# EAGLE design mcp23007_uln2803a (EAGLE 7.6.0)
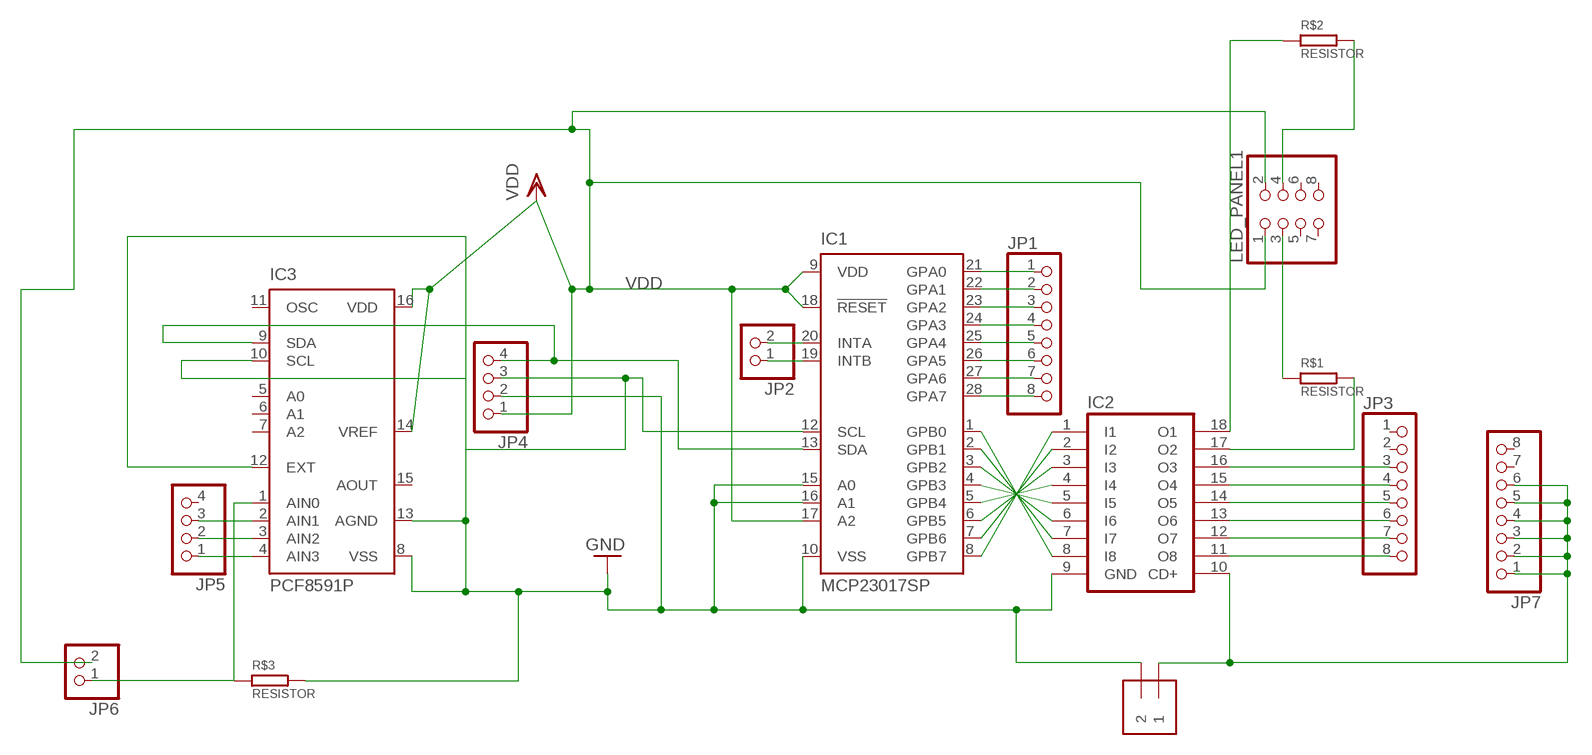
[diagram p0: schematic, sheet 1]

## Parts
IC1  MCP23017SP  [DIL28-3]
IC2  ULN2803A  [DIL18]
IC3  PCF8591P  [DIL16]
JP1  PINHD-1X8  [1X08]
JP2  PINHD-1X2  [1X02]
JP3  PINHD-1X8  [1X08]
JP4  PINHD-1X4  [1X04]
JP5  PINHD-1X4  [1X04]
JP6  PINHD-1X2  [1X02]
JP7  PINHD-1X8  [1X08]
LED_PANEL1  PINHD-2X4  [2X04]
R$1  RESISTOR  [RESISTOR_1/4]
R$2  RESISTOR  [RESISTOR_1/4]
R$3  RESISTOR  [RESISTOR_1/4]
VCC  1X2-3.5MM  [1X2-3.5MM]

## Nets
GND: IC1.10(VSS) IC1.15(A0) IC1.16(A1) IC2.9(GND) IC3.8(VSS) IC3.12(EXT) IC3.13(AGND) JP4.2 R$3.P$1 VCC.2
N$1: IC1.1(GPB0) IC2.8(I8)
N$2: IC1.8(GPB7) IC2.1(I1)
N$3: IC1.7(GPB6) IC2.2(I2)
N$4: IC1.2(GPB1) IC2.7(I7)
N$5: IC1.6(GPB5) IC2.3(I3)
N$6: IC1.3(GPB2) IC2.6(I6)
N$7: IC1.5(GPB4) IC2.4(I4)
N$8: IC1.4(GPB3) IC2.5(I5)
N$9: IC1.21(GPA0) JP1.1
N$10: IC1.22(GPA1) JP1.2
N$11: IC1.23(GPA2) JP1.3
N$12: IC1.24(GPA3) JP1.4
N$13: IC1.25(GPA4) JP1.5
N$14: IC1.26(GPA5) JP1.6
N$15: IC1.27(GPA6) JP1.7
N$16: IC1.28(GPA7) JP1.8
N$19: IC2.16(O3) JP3.3
N$20: IC2.15(O4) JP3.4
N$21: IC2.14(O5) JP3.5
N$22: IC2.13(O6) JP3.6
N$23: IC2.12(O7) JP3.7
N$24: IC2.11(O8) JP3.8
N$25: IC2.10(CD+) JP7.1 JP7.2 JP7.3 JP7.4 JP7.5 JP7.6 VCC.1
N$26: IC1.19(INTB) JP2.1
N$27: IC1.20(INTA) JP2.2
N$28: IC1.13(SDA) IC3.9(SDA) JP4.4
N$29: IC1.12(SCL) IC3.10(SCL) JP4.3
N$30: IC3.4(AIN3) JP5.1
N$31: IC3.3(AIN2) JP5.2
N$32: IC3.2(AIN1) JP5.3
N$33: IC3.1(AIN0) JP6.1 R$3.P$2
N$34: IC2.18(O1) R$2.P$2
N$35: LED_PANEL1.3 R$1.P$2
N$36: IC2.17(O2) R$1.P$1
N$39: LED_PANEL1.4 R$2.P$1
VDD: IC1.9(VDD) IC1.17(A2) IC1.18(!RESET) IC3.14(VREF) IC3.16(VDD) JP4.1 JP6.2 LED_PANEL1.1 LED_PANEL1.2
Unconnected: IC3.5(A0) IC3.6(A1) IC3.7(A2) IC3.11(OSC) IC3.15(AOUT) JP3.1 JP3.2 JP5.4 JP7.7 JP7.8 LED_PANEL1.5 LED_PANEL1.6 LED_PANEL1.7 LED_PANEL1.8

## Library data of the parts
IC1 = microchip:MCP23017: http://ww1.microchip.com/downloads/en/DeviceDoc/21952a.pdf Source: http://ww1.microchip.com/downloads/en/DeviceDoc/21952a.pdf; MF: MICROCHIP; MPN: MCP23017-E/SP; OC_FARNELL: 1332088; OC_NEWARK: 31K2959
IC2 = uln-udn:ULN2803A: DRIVER ARRAY
IC3 = micro-philips:PCF8591: I2C-Bus D/A CONVERTER; MF: FARNELL; MPN: PCF8591P; OC_FARNELL: 396412; OC_NEWARK: 07WX3385
JP1 JP3 JP7 = pinhead:PINHD-1X8: PIN HEADER
JP2 JP6 = pinhead:PINHD-1X2: PIN HEADER
JP4 JP5 = pinhead:PINHD-1X4: PIN HEADER
LED_PANEL1 = pinhead:PINHD-2X4: PIN HEADER
R$1-R$3 = pigoda:RESISTOR
VCC = adafruit:1X2: 3.5mm Terminal block http://www.ladyada.net/library/pcb/eaglelibrary.html

## Board
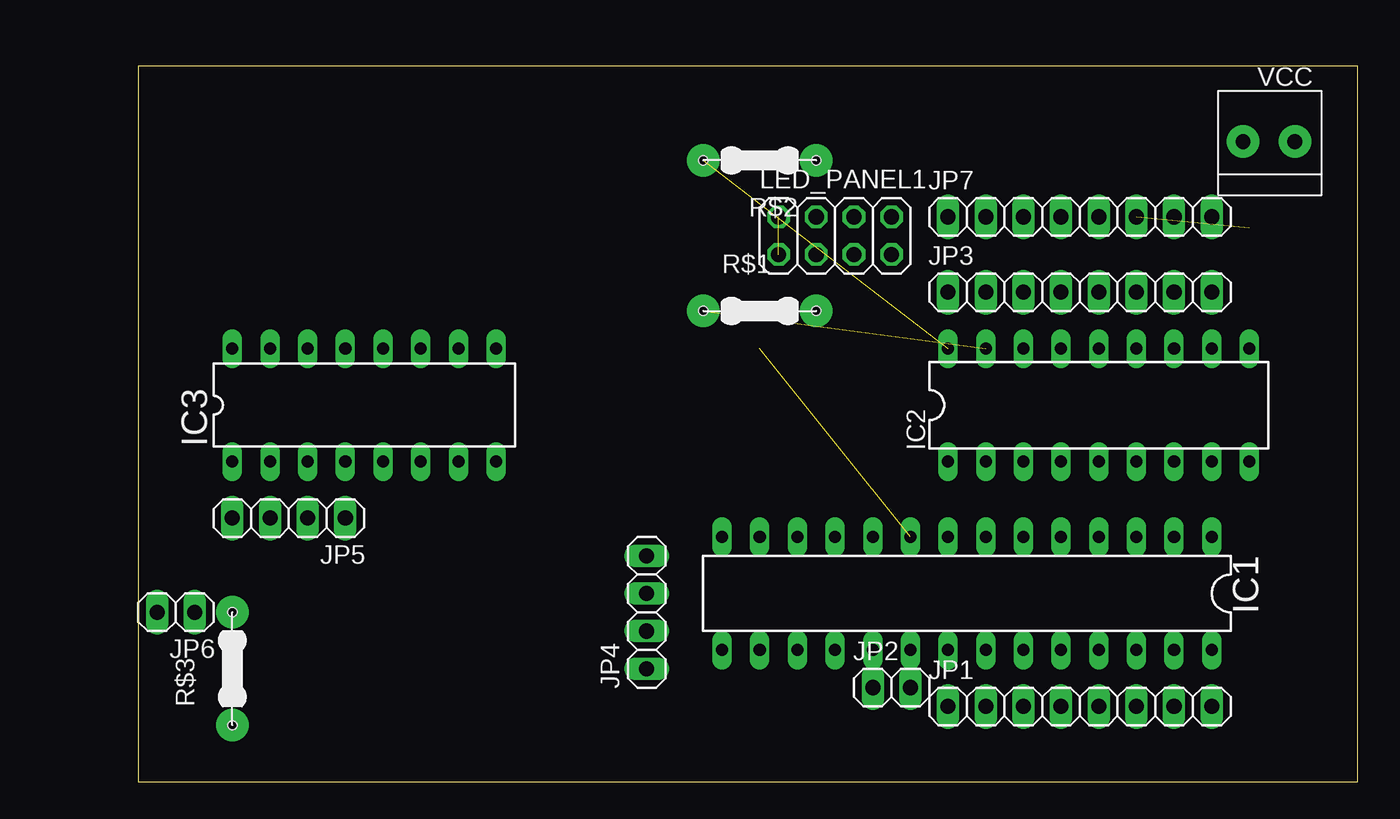
[diagram p1: board, top side]
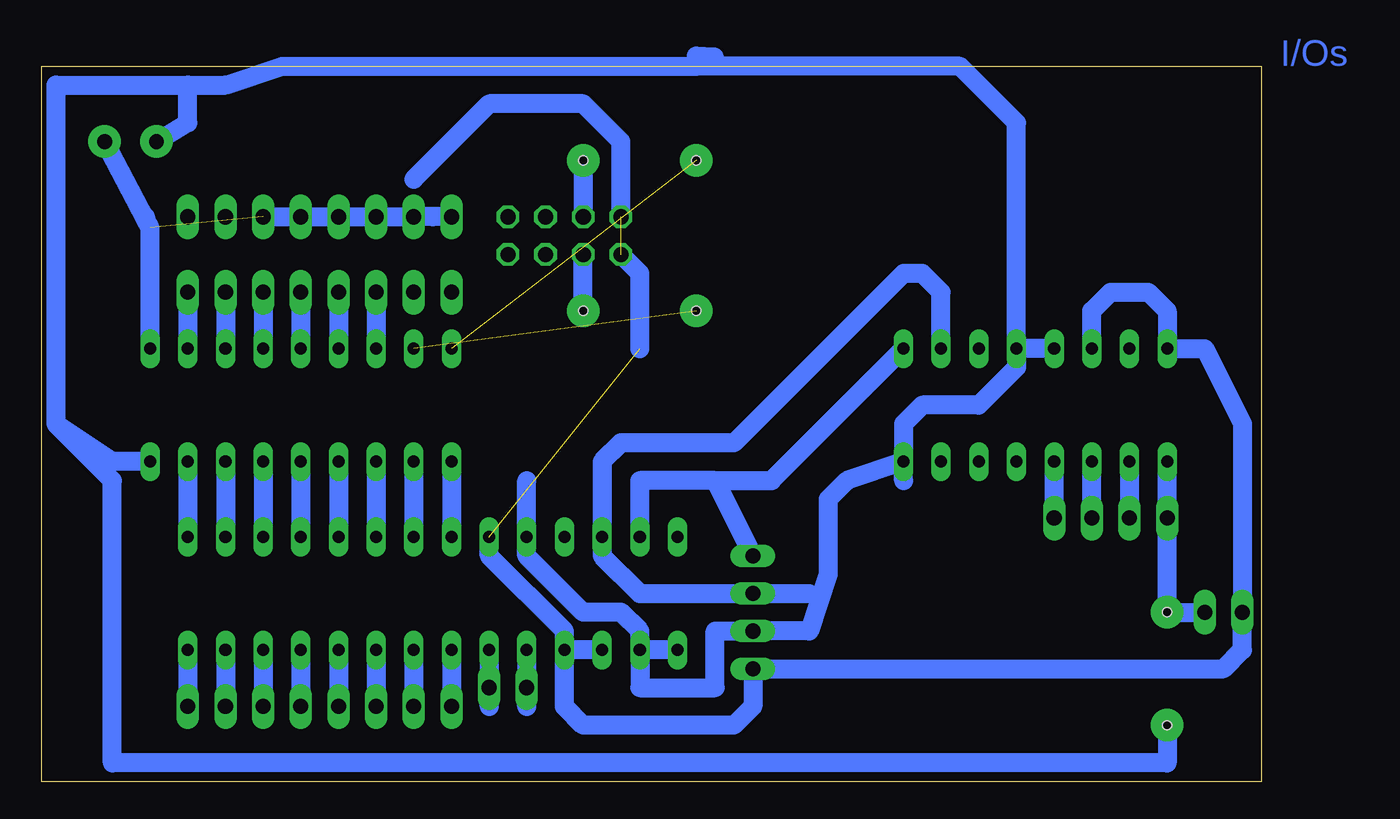
[diagram p2: board, bottom side, seen from below]

Size 82.22 x 48.25 mm. Coordinates in mm from the lower left corner, seen from the top.
Outline: 0,0 82.22,0 82.22,48.25 0,48.25 0,0
Copper layers (1*16): Top 0.035mm / dielectric 1.5mm / Bottom 0.035mm
Design rules "default": minimum track width 10mil, minimum drill 24mil, track to track 8mil, track to pad 8mil, pad to pad 8mil, via to via 8mil, smd to smd 8mil, copper to edge 40mil, drill to drill 8mil, minimum pad ring 10mil, minimum via ring 8mil, stop-mask expansion 4mil, vias tented up to drill 0mil, thermal gap 10mil

### Footprints (pad centres in the part's own frame; a part is rotated, then mirrored left to right if it is on the bottom)
DIL28-3 = drill 0.813 long: 1 -16.51,-3.81; 2 -13.97,-3.81; 3 -11.43,-3.81; 4 -8.89,-3.81; 5 -6.35,-3.81; 6 -3.81,-3.81; 7 -1.27,-3.81; 8 1.27,-3.81; 9 3.81,-3.81; 10 6.35,-3.81; 11 8.89,-3.81; 12 11.43,-3.81; 13 13.97,-3.81; 14 16.51,-3.81; 15 16.51,3.81; 16 13.97,3.81; 17 11.43,3.81; 18 8.89,3.81; 19 6.35,3.81; 20 3.81,3.81; 21 1.27,3.81; 22 -1.27,3.81; 23 -3.81,3.81; 24 -6.35,3.81; 25 -8.89,3.81; 26 -11.43,3.81; 27 -13.97,3.81; 28 -16.51,3.81
DIL18 = drill 0.813 long: 1 -10.16,-3.81; 2 -7.62,-3.81; 3 -5.08,-3.81; 4 -2.54,-3.81; 5 0,-3.81; 6 2.54,-3.81; 7 5.08,-3.81; 8 7.62,-3.81; 9 10.16,-3.81; 10 10.16,3.81; 11 7.62,3.81; 12 5.08,3.81; 13 2.54,3.81; 14 0,3.81; 15 -2.54,3.81; 16 -5.08,3.81; 17 -7.62,3.81; 18 -10.16,3.81
DIL16 = drill 0.813 long: 1 -8.89,-3.81; 2 -6.35,-3.81; 3 -3.81,-3.81; 4 -1.27,-3.81; 5 1.27,-3.81; 6 3.81,-3.81; 7 6.35,-3.81; 8 8.89,-3.81; 9 8.89,3.81; 10 6.35,3.81; 11 3.81,3.81; 12 1.27,3.81; 13 -1.27,3.81; 14 -3.81,3.81; 15 -6.35,3.81; 16 -8.89,3.81
1X08 = drill 1.016 long: 1 -8.89,0; 2 -6.35,0; 3 -3.81,0; 4 -1.27,0; 5 1.27,0; 6 3.81,0; 7 6.35,0; 8 8.89,0
1X02 = drill 1.016 long: 1 -1.27,0; 2 1.27,0
1X04 = drill 1.016 long: 1 -3.81,0; 2 -1.27,0; 3 1.27,0; 4 3.81,0
2X04 = drill 1.016 octagon: 1 -3.81,-1.27; 2 -3.81,1.27; 3 -1.27,-1.27; 4 -1.27,1.27; 5 1.27,-1.27; 6 1.27,1.27; 7 3.81,-1.27; 8 3.81,1.27
RESISTOR_1/4 = drill 0.7 pad 2.184: P$1 -3.81,0; P$2 3.81,0 | hole 0.6: -3.81,0; 3.81,0
1X2-3.5MM = drill 1 pad 2.184: 1 1.8,0; 2 -1.7,0

### Placement (x,y rotation side)
IC1  55.88,12.7 180 top
IC2  64.77,25.4 0 top
IC3  15.24,25.4 0 top
JP1  63.5,5.08 0 top
JP2  50.8,6.35 0 top
JP3  63.5,33.02 0 top
JP4  34.29,11.43 90 top
JP5  10.16,17.78 180 top
JP6  2.54,11.43 180 top
JP7  63.5,38.1 0 top
LED_PANEL1  46.99,36.83 0 top
R$1  41.91,31.75 0 top
R$2  41.91,41.91 180 top
R$3  6.35,7.62 90 top
VCC  76.2,43.18 0 top

### Tracks (layer width: path | path; a pad name or v marks a point on that pad's centre or on a via)
GND
  Bottom 1.27: 49.53,20.32 IC1.10 49.53,15.24 45.72,11.43 43.18,11.43 41.91,10.16 IC1.16 | IC2.9 77.47,21.59 81.28,24.13 | 72.39,46.99 81.28,46.99 81.28,24.13 | 74.93,43.18 VCC.2 72.39,44.45 72.39,46.99 | IC1.16 41.91,6.35 36.83,6.35 36.83,10.16 JP4.2 30.48,10.16 29.21,13.97 29.21,19.05 27.94,20.32 IC3.8 | IC1.15 IC1.16 | 81.28,24.13 77.47,20.32 77.47,1.27 6.35,1.27 R$3.P$1 | IC3.13 IC3.12 | IC3.12 16.51,44.45 20.32,48.26 38.1,48.26 | 38.1,48.26 38.1,48.96 36.89,48.89 | 72.39,46.99 69.85,46.99 66.04,48.26 38.1,48.26 | IC3.12 16.51,27.94 19.05,25.4 22.86,25.4 24.13,24.13 IC3.8 | 24.13,20.32 IC3.8
N$1
  Bottom 1.27: IC2.8 IC1.1
N$2
  Bottom 1.27: IC2.1 IC1.8
N$3
  Bottom 1.27: IC2.2 IC1.7
N$4
  Bottom 1.27: IC2.7 IC1.2
N$5
  Bottom 1.27: IC2.3 IC1.6
N$6
  Bottom 1.27: IC2.6 IC1.3
N$7
  Bottom 1.27: IC2.4 IC1.5
N$8
  Bottom 1.27: IC2.5 IC1.4
N$9
  Bottom 1.27: IC1.21 JP1.1
N$10
  Bottom 1.27: IC1.22 JP1.2
N$11
  Bottom 1.27: IC1.23 JP1.3
N$12
  Bottom 1.27: IC1.24 JP1.4
N$13
  Bottom 1.27: IC1.25 JP1.5
N$14
  Bottom 1.27: IC1.26 JP1.6
N$15
  Bottom 1.27: IC1.27 JP1.7
N$16
  Bottom 1.27: IC1.28 JP1.8
N$19
  Bottom 1.27: JP3.3 IC2.16
N$20
  Bottom 1.27: JP3.4 IC2.15
N$21
  Bottom 1.27: JP3.5 IC2.14
N$22
  Bottom 1.27: JP3.6 IC2.13
N$23
  Bottom 1.27: JP3.7 IC2.12
N$24
  Bottom 1.27: JP3.8 IC2.11
N$25  (1 unrouted)
  Bottom 1.27: IC2.10 74.93,37.36 75.24,37.93 | 75.24,37.93 VCC.1 | 75.24,38.1 75.24,37.93 | JP7.6 JP7.5 JP7.4 JP7.3 JP7.2 | 55.88,38.1 JP7.2 | JP7.1 JP7.2
N$26
  Bottom 1.27: IC1.19 JP2.1 49.53,5.08
N$27
  Bottom 1.27: IC1.20 JP2.2 52.07,5.08
N$28
  Bottom 1.27: IC1.13 41.91,20.32 36.83,20.32 | 36.83,20.32 JP4.4 | 36.83,20.32 33.02,20.32 IC3.9
N$29
  Bottom 1.27: 30.48,12.7 JP4.3 41.91,12.7 44.45,15.24 IC1.12 44.45,21.59 43.18,22.86 35.56,22.86 24.13,34.29 22.86,34.29 21.59,33.02 IC3.10
N$30
  Bottom 1.27: JP5.1 IC3.4
N$31
  Bottom 1.27: JP5.2 IC3.3
N$32
  Bottom 1.27: IC3.2 JP5.3
N$33
  Bottom 1.27: IC3.1 R$3.P$2 JP6.1
N$34  (1 unrouted)
N$35
  Bottom 1.27: R$1.P$2 LED_PANEL1.3
N$36  (1 unrouted)
N$39
  Bottom 1.27: R$2.P$1 LED_PANEL1.4
VDD  (2 unrouted)
  Bottom 1.27: IC1.18 46.99,5.08 45.72,3.81 35.56,3.81 34.29,5.08 JP4.1 2.54,7.62 1.27,8.89 JP6.2 1.27,24.13 3.81,29.21 IC3.16 6.35,31.75 7.62,33.02 10.16,33.02 11.43,31.75 IC3.14 | IC1.17 IC1.18 | IC1.18 46.99,10.16 52.07,15.24 IC1.9 | LED_PANEL1.2 43.18,43.18 45.72,45.72 52.07,45.72 57.15,40.64 | 41.91,29.21 41.91,34.29 LED_PANEL1.1

### Text on the board
Bottom: I/Os